# Altium schematic sheet TP_IHM_BUZZER.SchDoc
size A4
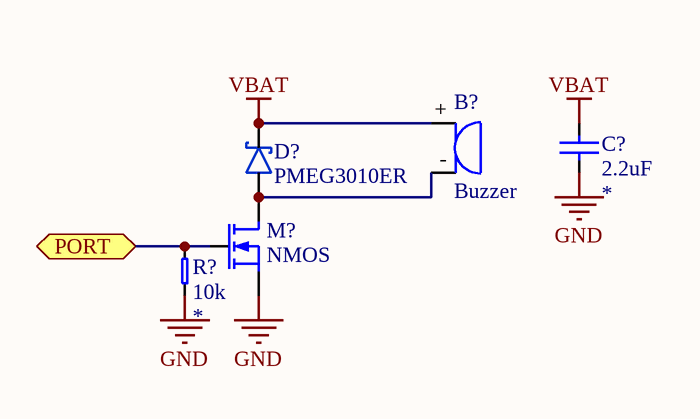
[diagram p0: TP_IHM_BUZZER.SchDoc]

## Parts
B?  Buzzer  [SD160709]
C?  value 2.2uF  [0603_CAP_LD]  (hidden comment: CerCap)
D?  PMEG3010ER  [SOD123W]
M?  NMOS  [MOSFET-SOT23]
R?  value 10k  [0603_RES_LD]  (hidden comment: Resistor)

## Ports
PORT

## Nets
GND: C?.1 M?.S R?.1
VBAT: B?.+ C?.2 D?.K
PORT: M?.G R?.2 ; port PORT
NetB?_-: B?.- D?.A M?.D

## Library data of the parts
B? = SD160709: TDK SD160709 Buzzer; Reference: SD160709
C? = CerCap: Ceramic Capacitor; Type: *; Voltage/Power: *; Package: *
D? = Schottky_PMEG3010ER: Nexperia 1A low Vf Mega Schottky barrier rectifier; Reference: PMEG3010ER
M? = N-MOSFET: N MOSFET
R? = Resistor: Precision: *; Package: *